# Altium project Switch Panel.PrjPcb
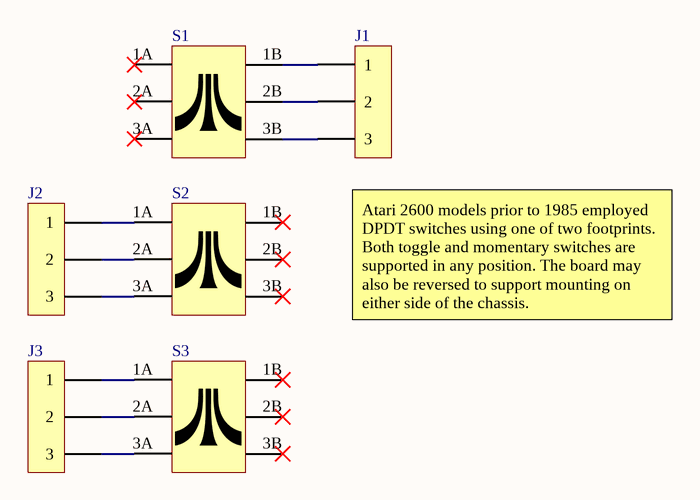
[diagram p0: Switch Panel.SchDoc]
1 sheet, 6 parts. Net scope: global (net labels, ports and power ports of the same name join across sheets).

## Sheet Switch Panel.SchDoc: Atari 2600 Switch Panel
size Letter; DrawnBy: S. Stallion; Revision: 1.1; SheetNumber: 1; SheetTotal: 1; ProjectURL: https://github.com/sstallion/AtariPie; SheetTitle: Top Sheet

### Parts
J1  Switch Header  [HDR1X3]  (value not drawn)
J2  Switch Header  [HDR1X3]  (value not drawn)
J3  Switch Header  [HDR1X3]  (value not drawn)
S1  SWITCH  [SWITCH]  (value not drawn)
S2  SWITCH  [SWITCH]  (value not drawn)
S3  SWITCH  [SWITCH]  (value not drawn)

### Nets
NetJ1_1: J1.1 S1.1B
NetJ1_2: J1.2 S1.2B
NetJ1_3: J1.3 S1.3B
NetJ2_1: J2.1 S2.1A
NetJ2_2: J2.2 S2.2A
NetJ2_3: J2.3 S2.3A
NetJ3_1: J3.1 S3.1A
NetJ3_2: J3.2 S3.2A
NetJ3_3: J3.3 S3.3A

Not connected (* = marked no-connect by the designer): S1 1A* 2A* 3A*; S2 1B* 2B* 3B*; S3 1B* 2B* 3B*

### Notes on the sheet
- (near J1) Atari 2600 models prior to 1985 employed DPDT switches using one of two footprints. Both toggle and momentary switches are supported in any position. The board may also be reversed to support mounting on either side of the chassis.
- Date:
- Time:
- Revision:
- Sheet
- of
- USE OF THIS DESIGN IS GOVERNED BY A BSD-STYLE LICENSE THAT CAN BE FOUND IN THE LICENSE FILE
- File:

### Library data of the parts
S1-S3 = SWITCH: DPDT Switch